# Altium project RiceCookerPCBA.PrjPcb
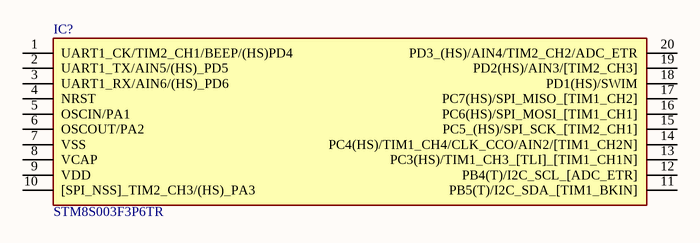
[diagram p0: MCU.SchDoc]
3 sheets, 1 parts. Net scope: global (net labels, ports and power ports of the same name join across sheets).
Sheets:
  power.SchDoc
  MCU.SchDoc
  sevenSegment.SchDoc

## Sheet power.SchDoc
size A

## Sheet MCU.SchDoc
size A

### Parts
IC?  STM8S003F3P6TR  [SOP65P640X120-20N]

### Nets

Not connected (* = marked no-connect by the designer): IC? 1(UART1_CK/TIM2_CH1/BEEP/(HS)PD4) 2(UART1_TX/AIN5/(HS)_PD5) 3(UART1_RX/AIN6/(HS)_PD6) 4(NRST) 5(OSCIN/PA1) 6(OSCOUT/PA2) 7(VSS) 8(VCAP) 9(VDD) 10([SPI_NSS]_TIM2_CH3/(HS)_PA3) 11(PB5(T)/I2C_SDA_[TIM1_BKIN]) 12(PB4(T)/I2C_SCL_[ADC_ETR]) 13(PC3(HS)/TIM1_CH3_[TLI]_[TIM1_CH1N]) 14(PC4(HS)/TIM1_CH4/CLK_CCO/AIN2/[TIM1_CH2N]) 15(PC5_(HS)/SPI_SCK_[TIM2_CH1]) 16(PC6(HS)/SPI_MOSI_[TIM1_CH1]) 17(PC7(HS)/SPI_MISO_[TIM1_CH2]) 18(PD1(HS)/SWIM) 19(PD2(HS)/AIN3/[TIM2_CH3]) 20(PD3_(HS)/AIN4/TIM2_CH2/ADC_ETR)

### Library data of the parts
IC? = STM8S003F3P6TR: Integrated Circuit; Manufacturer_Name: STMicroelectronics; Datasheet Link: http://www.st.com/content/ccc/resource/technical/document/datasheet/42/5a/27/87/ac/5a/44/88/DM00024550.pdf/files/DM00024550.pdf/jcr:content/translations/en.DM00024550.pdf; Height: 1.2mm; Manufacturer_Part_Number: STM8S003F3P6TR; Arrow Part Number: STM8S003F3P6TR; Arrow Price/Stock: https://www.arrow.com/en/products/stm8s003f3p6tr/stmicroelectronics; Mouser Part Number: 511-STM8S003F3P6TR; Mouser Price/Stock: https://www.mouser.co.uk/ProductDetail/STMicroelectronics/STM8S003F3P6TR?qs=gNDSiZmRJS%2FJPpJyWAyIVQ%3D%3D

## Sheet sevenSegment.SchDoc
size A